# Altium schematic sheet DE-020717_1.SchDoc: CuC & SDRAM &  ANIN & DIO
size A3; Author: eldar6776@hotmail.com; DrawnBy: Dedic Eldar; Organization: I-MEDIA GROUP d.o.o.; Address1: Topal Osman Paše 18; Address2: 71000 Sarajevo; Address3: Federacija BiH; Address4: Bosna i Hercegovina; DocumentNumber: DE-020717; Revision: 001
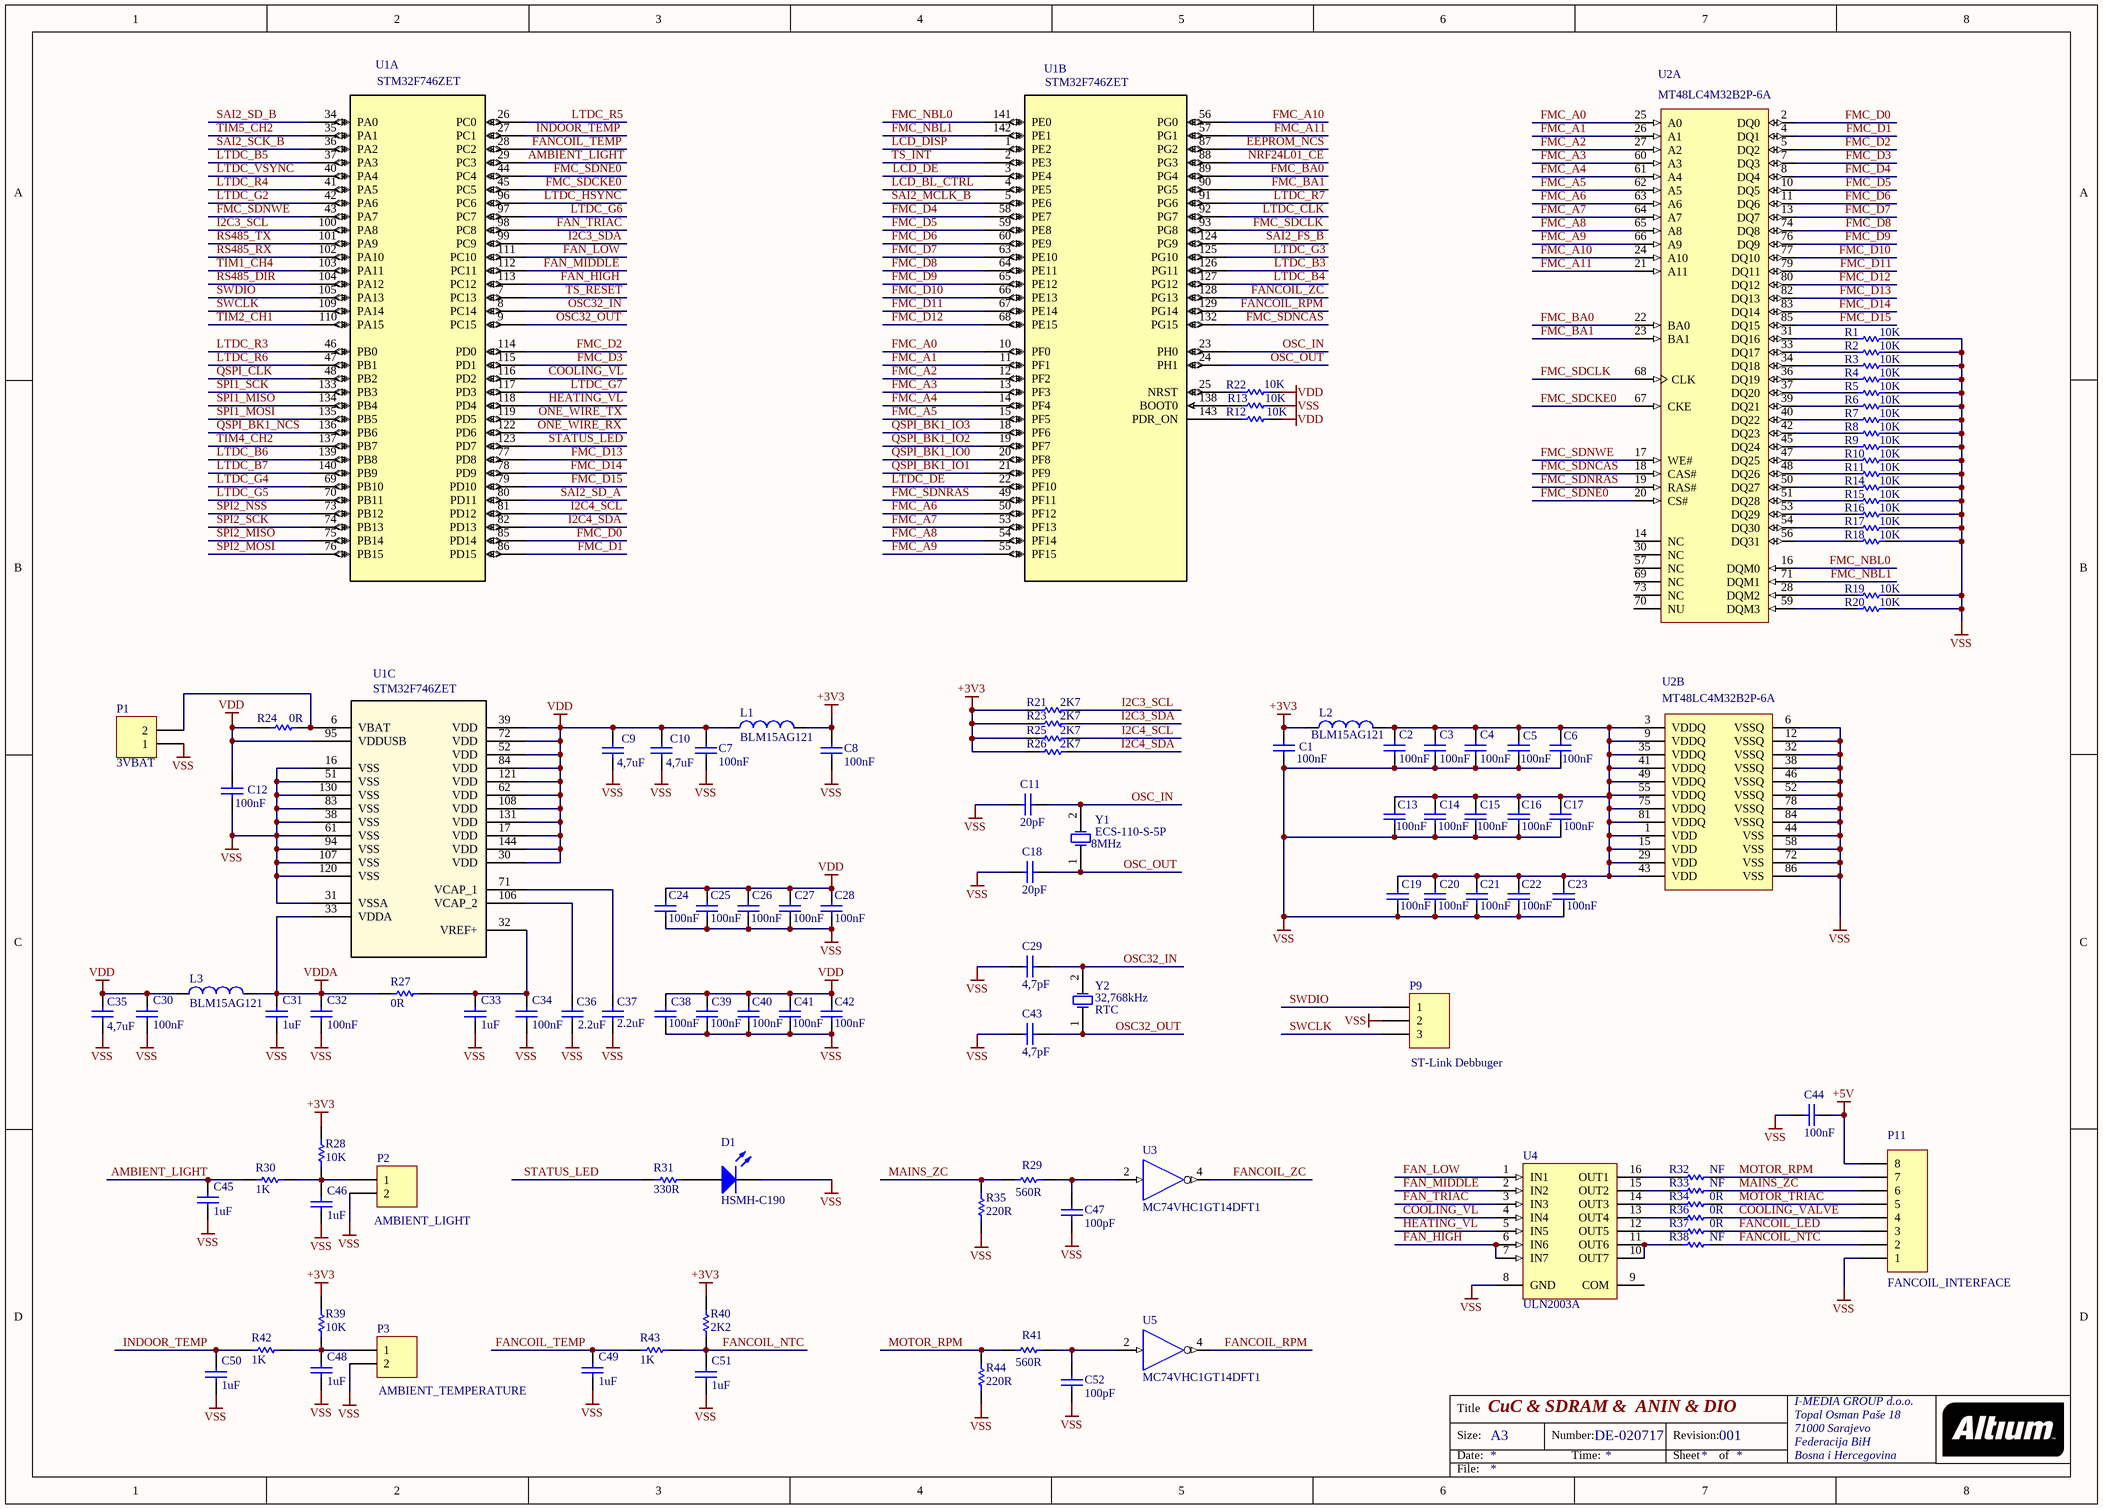
[diagram p0: DE-020717_1.SchDoc]

## Parts
C1  100nF  [0603]
C2  100nF  [0603]
C3  100nF  [0603]
C4  100nF  [0603]
C5  100nF  [0603]
C6  100nF  [0603]
C7  100nF  [0603]
C8  100nF  [0603]
C9  value 4,7uF  [0805]  (hidden comment: 4u7)
C10  value 4,7uF  [0805]  (hidden comment: 4u7)
C11  20pF  [0603]
C12  100nF  [0603]
C13  100nF  [0603]
C14  100nF  [0603]
C15  100nF  [0603]
C16  100nF  [0603]
C17  100nF  [0603]
C18  20pF  [0603]
C19  100nF  [0603]
C20  100nF  [0603]
C21  100nF  [0603]
C22  100nF  [0603]
C23  100nF  [0603]
C24  100nF  [0603]
C25  100nF  [0603]
C26  100nF  [0603]
C27  100nF  [0603]
C28  100nF  [0603]
C29  4,7pF  [0603]
C30  100nF  [0603]
C31  value 1uF  [0603]  (hidden comment: 100nF)
C32  100nF  [0603]
C33  value 1uF  [0603]  (hidden comment: 100nF)
C34  100nF  [0603]
C35  value 4,7uF  [0805]  (hidden comment: 4u7)
C36  value 2.2uF  [0603]  (hidden comment: 100nF)
C37  value 2.2uF  [0603]  (hidden comment: 100nF)
C38  100nF  [0603]
C39  100nF  [0603]
C40  100nF  [0603]
C41  100nF  [0603]
C42  100nF  [0603]
C43  4,7pF  [0603]
C44  100nF  [0603]
C45  value 1uF  [0603]  (hidden comment: 100nF)
C46  value 1uF  [0603]  (hidden comment: 100nF)
C47  100pF  [0603]
C48  value 1uF  [0603]  (hidden comment: 100nF)
C49  value 1uF  [0603]  (hidden comment: 100nF)
C50  value 1uF  [0603]  (hidden comment: 100nF)
C51  value 1uF  [0603]  (hidden comment: 100nF)
C52  100pF  [0603]
D1  HSMH-C190  [1.6X0.8X0.8A]
L1  BLM15AG121  [0603]
L2  BLM15AG121  [0603]
L3  BLM15AG121  [0603]
P1  3VBAT  [HDR1X2]
P2  AMBIENT_LIGHT  [HDR1X2]
P3  AMBIENT_TEMPERATURE  [HDR1X2]
P9  ST-Link Debbuger  [HDR1X3]
P11  FANCOIL_INTERFACE  [HDR1X8]
R1  10K  [2-0402]
R2  10K  [2-0402]
R3  10K  [2-0402]
R4  10K  [2-0402]
R5  10K  [2-0402]
R6  10K  [2-0402]
R7  10K  [2-0402]
R8  10K  [2-0402]
R9  10K  [2-0402]
R10  10K  [2-0402]
R11  10K  [2-0402]
R12  10K  [ERA-0603]
R13  10K  [ERA-0603]
R14  10K  [2-0402]
R15  10K  [2-0402]
R16  10K  [2-0402]
R17  10K  [2-0402]
R18  10K  [2-0402]
R19  10K  [2-0402]
R20  10K  [2-0402]
R21  2K7  [ERA-0603]
R22  10K  [ERA-0603]
R23  2K7  [ERA-0603]
R24  0R  [ERA-0603]
R25  2K7  [ERA-0603]
R26  2K7  [ERA-0603]
R27  0R  [ERA-0603]
R28  10K  [ERA-0603]
R29  560R  [ERA-0603]
R30  1K  [ERA-0603]
R31  330R  [ERA-0603]
R32  NF  [ERA-0603]
R33  NF  [ERA-0603]
R34  0R  [ERA-0603]
R35  220R  [ERA-0603]
R36  0R  [ERA-0603]
R37  0R  [ERA-0603]
R38  NF  [ERA-0603]
R39  10K  [ERA-0603]
R40  2K2  [ERA-0603]
R41  560R  [ERA-0603]
R42  1K  [ERA-0603]
R43  1K  [ERA-0603]
R44  220R  [ERA-0603]
U1  STM32F746ZET  [LQFP-144_20X20mm]  (parts A,B,C of 3)
U2  MT48LC4M32B2P-6A  [MICT-P-86_N]  (parts A,B of 2)
U3  MC74VHC1GT14DFT1  [419A-01_N]
U4  ULN2003A  [SO16_N]
U5  MC74VHC1GT14DFT1  [419A-01_N]
Y1  ECS-110-S-5P  value 8MHz  [CSM-7]
Y2  RTC  value 32,768kHz  [R38]

## Nets
+3V3: C1.2 C8.2 L1.2 L2.1 R21.1 R23.1 R25.1 R26.1 R28.2 R39.1 R40.2 U3.5(VDD) U5.5(VDD)
+5V: C44.2 P11.8
VDD: C7.2 C9.2 C10.2 C12.1 C24.2 C25.2 C26.2 C27.2 C28.2 C30.2 C35.2 C38.2 C39.2 C40.2 C41.2 C42.2 L1.1 L3.1 R12.2 R22.2 R24.1 U1.17(VDD) U1.30(VDD) U1.39(VDD) U1.52(VDD) U1.62(VDD) U1.72(VDD) U1.84(VDD) U1.95(VDDUSB) U1.108(VDD) U1.121(VDD) U1.131(VDD) U1.144(VDD)
VDDA: C31.2 C32.2 L3.2 R27.1 U1.33(VDDA)
VSS: C1.1 C2.1 C3.1 C4.1 C5.1 C6.1 C7.1 C8.1 C9.1 C10.1 C11.1 C12.2 C13.1 C14.1 C15.1 C16.1 C17.1 C18.1 C19.1 C20.1 C21.1 C22.1 C23.1 C24.1 C25.1 C26.1 C27.1 C28.1 C29.1 C30.1 C31.1 C32.1 C33.1 C34.1 C35.1 C36.1 C37.1 C38.1 C39.1 C40.1 C41.1 C42.1 C43.1 C44.1 C45.1 C46.1 C47.1 C48.1 C49.1 C50.1 C51.1 C52.1 D1.2(K) P1.1 P2.2 P3.2 P9.2 P11.1 R1.2 R2.2 R3.2 R4.2 R5.2 R6.2 R7.2 R8.2 R9.2 R10.2 R11.2 R13.2 R14.2 R15.2 R16.2 R17.2 R18.2 R19.2 R20.2 R35.1 R44.1 U1.16(VSS) U1.31(VSSA) U1.38(VSS) U1.51(VSS) U1.61(VSS) U1.83(VSS) U1.94(VSS) U1.107(VSS) U1.120(VSS) U1.130(VSS) U2.6(VSSQ) U2.12(VSSQ) U2.32(VSSQ) U2.38(VSSQ) U2.44(VSS) U2.46(VSSQ) U2.52(VSSQ) U2.58(VSS) U2.72(VSS) U2.78(VSSQ) U2.84(VSSQ) U2.86(VSS) U3.3(GND) U4.8(GND) U5.3(GND)
AMBIENT_LIGHT: C45.2 R30.1 U1.29(PC3)
COOLING_VALVE: P11.4 R36.2
COOLING_VL: U1.116(PD2) U4.4(IN4)
EEPROM_NCS: U1.87(PG2)
FAN_HIGH: U1.113(PC12) U4.6(IN6) U4.7(IN7)
FAN_LOW: U1.111(PC10) U4.1(IN1)
FAN_MIDDLE: U1.112(PC11) U4.2(IN2)
FAN_TRIAC: U1.98(PC8) U4.3(IN3)
FANCOIL_LED: P11.3 R37.2
FANCOIL_NTC: C51.2 P11.2 R38.2 R40.1 R43.2
FANCOIL_RPM: U1.129(PG14) U5.4(~{Y})
FANCOIL_TEMP: C49.2 R43.1 U1.28(PC2)
FANCOIL_ZC: U1.128(PG13) U3.4(~{Y})
FMC_A0: U1.10(PF0) U2.25(A0)
FMC_A1: U1.11(PF1) U2.26(A1)
FMC_A2: U1.12(PF2) U2.27(A2)
FMC_A3: U1.13(PF3) U2.60(A3)
FMC_A4: U1.14(PF4) U2.61(A4)
FMC_A5: U1.15(PF5) U2.62(A5)
FMC_A6: U1.50(PF12) U2.63(A6)
FMC_A7: U1.53(PF13) U2.64(A7)
FMC_A8: U1.54(PF14) U2.65(A8)
FMC_A9: U1.55(PF15) U2.66(A9)
FMC_A10: U1.56(PG0) U2.24(A10)
FMC_A11: U1.57(PG1) U2.21(A11)
FMC_BA0: U1.89(PG4) U2.22(BA0)
FMC_BA1: U1.90(PG5) U2.23(BA1)
FMC_D0: U1.85(PD14) U2.2(DQ0)
FMC_D1: U1.86(PD15) U2.4(DQ1)
FMC_D2: U1.114(PD0) U2.5(DQ2)
FMC_D3: U1.115(PD1) U2.7(DQ3)
FMC_D4: U1.58(PE7) U2.8(DQ4)
FMC_D5: U1.59(PE8) U2.10(DQ5)
FMC_D6: U1.60(PE9) U2.11(DQ6)
FMC_D7: U1.63(PE10) U2.13(DQ7)
FMC_D8: U1.64(PE11) U2.74(DQ8)
FMC_D9: U1.65(PE12) U2.76(DQ9)
FMC_D10: U1.66(PE13) U2.77(DQ10)
FMC_D11: U1.67(PE14) U2.79(DQ11)
FMC_D12: U1.68(PE15) U2.80(DQ12)
FMC_D13: U1.77(PD8) U2.82(DQ13)
FMC_D14: U1.78(PD9) U2.83(DQ14)
FMC_D15: U1.79(PD10) U2.85(DQ15)
FMC_NBL0: U1.141(PE0) U2.16(DQM0)
FMC_NBL1: U1.142(PE1) U2.71(DQM1)
FMC_SDCKE0: U1.45(PC5) U2.67(CKE)
FMC_SDCLK: U1.93(PG8) U2.68(CLK)
FMC_SDNCAS: U1.132(PG15) U2.18(CAS#)
FMC_SDNE0: U1.44(PC4) U2.20(CS#)
FMC_SDNRAS: U1.49(PF11) U2.19(RAS#)
FMC_SDNWE: U1.43(PA7) U2.17(WE#)
HEATING_VL: U1.118(PD4) U4.5(IN5)
I2C3_SCL: R21.2 U1.100(PA8)
I2C3_SDA: R23.2 U1.99(PC9)
I2C4_SCL: R25.2 U1.81(PD12)
I2C4_SDA: R26.2 U1.82(PD13)
INDOOR_TEMP: C50.2 R42.1 U1.27(PC1)
LCD_BL_CTRL: U1.4(PE5)
LCD_DE: U1.3(PE4)
LCD_DISP: U1.1(PE2)
LTDC_B3: U1.126(PG11)
LTDC_B4: U1.127(PG12)
LTDC_B5: U1.37(PA3)
LTDC_B6: U1.139(PB8)
LTDC_B7: U1.140(PB9)
LTDC_CLK: U1.92(PG7)
LTDC_DE: U1.22(PF10)
LTDC_G2: U1.42(PA6)
LTDC_G3: U1.125(PG10)
LTDC_G4: U1.69(PB10)
LTDC_G5: U1.70(PB11)
LTDC_G6: U1.97(PC7)
LTDC_G7: U1.117(PD3)
LTDC_HSYNC: U1.96(PC6)
LTDC_R3: U1.46(PB0)
LTDC_R4: U1.41(PA5)
LTDC_R5: U1.26(PC0)
LTDC_R6: U1.47(PB1)
LTDC_R7: U1.91(PG6)
LTDC_VSYNC: U1.40(PA4)
MAINS_ZC: P11.6 R29.1 R33.2 R35.2
MOTOR_RPM: P11.7 R32.2 R41.1 R44.2
MOTOR_TRIAC: P11.5 R34.2
NRF24L01_CE: U1.88(PG3)
ONE_WIRE_RX: U1.122(PD6)
ONE_WIRE_TX: U1.119(PD5)
OSC32_IN: C29.2 U1.8(PC14) Y2.2(OSC2)
OSC32_OUT: C43.2 U1.9(PC15) Y2.1(OSC1)
OSC_IN: C11.2 U1.23(PH0) Y1.2(OSC2)
OSC_OUT: C18.2 U1.24(PH1) Y1.1(OSC1)
QSPI_BK1_IO0: U1.20(PF8)
QSPI_BK1_IO1: U1.21(PF9)
QSPI_BK1_IO2: U1.19(PF7)
QSPI_BK1_IO3: U1.18(PF6)
QSPI_BK1_NCS: U1.136(PB6)
QSPI_CLK: U1.48(PB2)
RS485_DIR: U1.104(PA12)
RS485_RX: U1.102(PA10)
RS485_TX: U1.101(PA9)
SAI2_FS_B: U1.124(PG9)
SAI2_MCLK_B: U1.5(PE6)
SAI2_SCK_B: U1.36(PA2)
SAI2_SD_A: U1.80(PD11)
SAI2_SD_B: U1.34(PA0)
SPI1_MISO: U1.134(PB4)
SPI1_MOSI: U1.135(PB5)
SPI1_SCK: U1.133(PB3)
SPI2_MISO: U1.75(PB14)
SPI2_MOSI: U1.76(PB15)
SPI2_NSS: U1.73(PB12)
SPI2_SCK: U1.74(PB13)
STATUS_LED: R31.2 U1.123(PD7)
SWCLK: P9.3 U1.109(PA14)
SWDIO: P9.1 U1.105(PA13)
TIM1_CH4: U1.103(PA11)
TIM2_CH1: U1.110(PA15)
TIM4_CH2: U1.137(PB7)
TIM5_CH2: U1.35(PA1)
TS_INT: U1.2(PE3)
TS_RESET: U1.7(PC13)
NetC2_2: C2.2 C3.2 C4.2 C5.2 C6.2 C13.2 C14.2 C15.2 C16.2 C17.2 C19.2 C20.2 C21.2 C22.2 C23.2 L2.2 U2.1(VDD) U2.3(VDDQ) U2.9(VDDQ) U2.15(VDD) U2.29(VDD) U2.35(VDDQ) U2.41(VDDQ) U2.43(VDD) U2.49(VDDQ) U2.55(VDDQ) U2.75(VDDQ) U2.81(VDDQ)
NetC33_2: C33.2 C34.2 R27.2 U1.32(VREF+)
NetC36_2: C36.2 U1.106(VCAP_2)
NetC37_2: C37.2 U1.71(VCAP_1)
NetC46_2: C46.2 P2.1 R28.1 R30.2
NetC47_2: C47.2 R29.2 U3.2(A)
NetC48_2: C48.2 P3.1 R39.2 R42.2
NetC52_2: C52.2 R41.2 U5.2(A)
NetD1_1: D1.1(A) R31.1
NetP1_2: P1.2 R24.2 U1.6(VBAT)
NetR1_1: R1.1 U2.31(DQ16)
NetR2_1: R2.1 U2.33(DQ17)
NetR3_1: R3.1 U2.34(DQ18)
NetR4_1: R4.1 U2.36(DQ19)
NetR5_1: R5.1 U2.37(DQ20)
NetR6_1: R6.1 U2.39(DQ21)
NetR7_1: R7.1 U2.40(DQ22)
NetR8_1: R8.1 U2.42(DQ23)
NetR9_1: R9.1 U2.45(DQ24)
NetR10_1: R10.1 U2.47(DQ25)
NetR11_1: R11.1 U2.48(DQ26)
NetR12_1: R12.1 U1.143(PDR_ON)
NetR13_1: R13.1 U1.138(BOOT0)
NetR14_1: R14.1 U2.50(DQ27)
NetR15_1: R15.1 U2.51(DQ28)
NetR16_1: R16.1 U2.53(DQ29)
NetR17_1: R17.1 U2.54(DQ30)
NetR18_1: R18.1 U2.56(DQ31)
NetR19_1: R19.1 U2.28(DQM2)
NetR20_1: R20.1 U2.59(DQM3)
NetR22_1: R22.1 U1.25(NRST)
NetR32_1: R32.1 U4.16(OUT1)
NetR33_1: R33.1 U4.15(OUT2)
NetR34_1: R34.1 U4.14(OUT3)
NetR36_1: R36.1 U4.13(OUT4)
NetR37_1: R37.1 U4.12(OUT5)
NetR38_1: R38.1 U4.10(OUT7) U4.11(OUT6)

Not connected (* = marked no-connect by the designer): U2 14(NC) 30(NC) 57(NC) 69(NC) 70(NU) 73(NC); U4 9(COM)

## Notes on the sheet
- Title
- Size:
- Date:
- A3
- Number:
- Time:
- Revision:
- Sheet
- of
- File:

## Library data of the parts
C1-C8 C11-C34 C36-C52 = C0603: Ceramic Chip Capacitor - Standard; Note: Footprint corresponds to dimensions for bulk cassette packaging. This case size has tightened tolerances.; Published: 17-Jul-2002; LatestRevisionDate: 19-Mar-2004; LatestRevisionNote: Silkscreen size reduced.; DatasheetDocument: Mar-2001; PackageDocument: Mar-2001; PackageReference: 0603; Publisher: Altium Limited; Code_JEITA: 0603; Code_IPC: 1608 [0603]; ComponentLink1Description: Manufacturer Link; ComponentLink1URL: http://www.kemet.com/; ComponentLink2Description: Datasheet; ComponentLink2URL: http://www.kemet.com/kemet/web/homepage/kechome.nsf/vapubfilesname/F3102TA.pdf/$file/F3102TA.pdf
  C1-C8 C12-C17 C19-C28 C30 C32 C34 C38-C42 C44: Value: 100nF
  C11 C18: Value: 20pF
  C29 C43: Value: 4,7pF
  C47 C52: Value: 100pF
C9 C10 C35 = C0805: Ceramic Chip Capacitor - Standard; Note: Footprint corresponds to dimensions for bulk cassette packaging. This case size has tightened tolerances.; Published: 17-Jul-2002; LatestRevisionDate: 19-Mar-2004; LatestRevisionNote: Silkscreen size reduced.; DatasheetDocument: Mar-2001; PackageDocument: Mar-2001; PackageReference: 0805; Publisher: Altium Limited; Code_JEITA: 0805; Code_IPC: 2012[0805]; ComponentLink1Description: Manufacturer Link; ComponentLink1URL: http://www.kemet.com/; ComponentLink2Description: Datasheet; ComponentLink2URL: http://www.kemet.com/kemet/web/homepage/kechome.nsf/vapubfilesname/F3102TA.pdf/$file/F3102TA.pdf
D1 = HSMH-C190: Surface Mount Chip LED, Red; LuminousIntensity: 6.3mcd (Minimum).; PCB_Layout: Complies with manufacturer's recommendation.; Note: Anode mark shown on package.; Published: 11-Dec-2002; LatestRevisionDate: 27-Jun-2008; LatestRevisionNote: Polarity swapped to match Anode Mark.; DatasheetVersion: 30-Apr-2002; PackageVersion: Mar-2002; PackageReference: 1.6X0.8X0.8A; Publisher: Altium Limited; PackageDescription: SM LED; 2 Flat Leads; LED_Colour: Red; ComponentLink1Description: Manufacturer Link; ComponentLink1URL: http://www.avagotech.com/; ComponentLink2Description: Datasheet; ComponentLink2URL: http://cp.literature.agilent.com/litweb/pdf/5988-6271EN.pdf
L1-L3 = Inductor_SMD: Inductor; Code_IEC: 1005; Published: 8-Jun-2000; LatestRevisionDate: 29-May-2009; LatestRevisionNote: IPC-7351 Footprint Added.; PackageReference: 0402-A; Publisher: Altium Limited; PackageDescription: Chip Inductor; Code_JEITA: 0402
P1-P3 = Header 2: Header, 2-Pin; LatestRevisionDate: 17-Jul-2002; LatestRevisionNote: Re-released for DXP Platform.; Publisher: Altium Limited
P9 = Header 3: Header, 3-Pin; LatestRevisionDate: 17-Jul-2002; LatestRevisionNote: Re-released for DXP Platform.; Publisher: Altium Limited
P11 = Header 8: Header, 8-Pin; LatestRevisionDate: 17-Jul-2002; LatestRevisionNote: Re-released for DXP Platform.; Publisher: Altium Limited
R1-R11 R14-R20 = ERJ2GE: Thick Film Chip Resistor, 1 Ohm to 2.2M Ohm Range, 5% Tolerance, 0402 Size, 0.063 W; Note: If flow soldering, adjust pad width of PCB Footprint to 0.7 - 0.8 times the width of the resistor.; Published: 17-Dec-2003; LatestRevisionDate: 19-Mar-2004; LatestRevisionNote: Silkscreen size reduced.; PackageDocument: Mar-2003; PackageReference: 2-0402; Publisher: Altium Limited; Code_IPC: 1005 [0402]; ComponentLink1Description: Manufacturer Link; ComponentLink1URL: http://www.panasonic.com/industrial/components/resistive_products.htm; ComponentLink2Description: Datasheet; ComponentLink2URL: http://www.panasonic.com/industrial/components/pdf/AOA0000CE1.pdf
R12 R13 R21-R44 = ERA3Y: Rectangular Thick Film Chip Resistor, 10 Ohm to 330k Ohm Range, 0.1% and 0.5% Tolerance, 0603 Size, 0.063 W; Note: If flow soldering, adjust pad width of PCB Footprint to 0.7 - 0.8 times the width of the resistor.; Published: 17-Dec-2003; LatestRevisionDate: 19-Mar-2004; LatestRevisionNote: Silkscreen size reduced.; PackageDocument: Mar-2003; PackageReference: ERA-0603; Publisher: Altium Limited; Code_IPC: 1608 [0603]; ComponentLink1Description: Manufacturer Link; ComponentLink1URL: http://www.panasonic.com/industrial/components/resistive_products.htm; ComponentLink2Description: Datasheet; ComponentLink2URL: http://www.panasonic.com/industrial/components/pdf/AOA0000CE8.pdf
U1 = STM32F74XZXT: STM32F746ZET ARM Cortex M7 microcontroller; Vendor: STMicroelectronics; C: Copyright (C) 2016 Accelerated Designs. All rights reserved; Manufacturer_Part_Number: stm32f74xzxt; Copyright: Copyright (C) 2016 Accelerated Designs. All rights reserved; RefDes: RefDes; Type: Type; Value: Value
U2 = MT48LC4M32B2P-6A: 128Mb PC133 SDR SDRAM, 4Mb x 32, 6ns, 3.3V, 0 to 70 degC, 86-Pin TSOP, Pb-Free; Manufacturer: Micron; CL: CL = 3; Clock Rate: 166 MHz; Op. Temp.: 0C to +70C; DatasheetVersion: Rev.Q; PackageVersion: Rev.Q; PackageReference: MICT-P-86; PackageDescription: 86-PinThin Small Outline Package, 10.16 x 22.22 mm, Pitch 0.5 mm; Cycle Time: 6ns; Data Rate: PC133; Density: 128Mb; Depth: 4Mb; RoHS: Yes; Voltage: 3.3V; Width: x32; Mounting Technology: Surface Mount; PartNumber: MT48LC4M32B2P-6A; ComponentLink1Description: Manufacturer URL; ComponentLink1URL: http://www.micron.com/; ComponentLink2Description: Datasheet; ComponentLink2URL: http://www.micron.com/~/media/Documents/Products/Data%20Sheet/DRAM/128mb_x32_sdram.pdf; ComponentLink3Description: Package Specification; ComponentLink3URL: http://www.micron.com/~/media/Documents/Products/Data%20Sheet/DRAM/128mb_x32_sdram.pdf
U3 U5 = MC74VHC1GT14DFT1: Schmitt-Trigger Inverter / Logic Level Shifter with LSTTL-Compatible Inputs; Note: Pin 1 is NC and is not drawn.; Published: 15-Apr-2002; LatestRevisionDate: 12-Dec-2006; LatestRevisionNote: IPC-7351 Footprint Added.; DatasheetVersion: Nov-1999; PackageVersion: Oct-1999; PackageReference: 419A-01; Publisher: Altium Limited; PackageDescription: 5-Pin SOT-353 Package 0.65 mm Pitch, 2.1 mm Lead Span; ComponentLink1Description: Manufacturer Link; ComponentLink1URL: http://www.onsemi.com/; ComponentLink2Description: Datasheet; ComponentLink2URL: http://www.onsemi.com/pub/Collateral/MC74VHC1GT14-D.PDF
U4 = ULN2003D: Seven Darlington Array; Published: 8-Jun-2000; LatestRevisionDate: 13-Apr-2006; LatestRevisionNote: IPC-7351 Footprint Added.; DatasheetVersion: Sep-1998; PackageVersion: May-1998; PackageReference: SO16; Publisher: Altium Limited; PackageDescription: 16-Pin Small Outline Integrated Circuit 1.27 mm Pitch; Code_IPC: SOIC127P600-16; ComponentLink1Description: Manufacturer Link; ComponentLink1URL: http://www.st.com/; ComponentLink2Description: Datasheet; ComponentLink2URL: http://www.st.com/stonline/products/literature/ds/5279/uln2001.pdf
Y1 = ECS-110-S-5P: Crystal Oscillator; Published: 17-Jul-2002; DatasheetDocument: 18-Apr-2000; PackageReference: CSM-7; Publisher: Altium Limited; ComponentLink1Description: Manufacturer Link; ComponentLink1URL: http://www.ecsxtal.com/; ComponentLink2Description: Datasheet; ComponentLink2URL: http://www.ecsxtal.com/pdf3/CSM_7.pdf
Y2 = XTAL: Crystal Oscillator; Published: 8-Jun-2000; LatestRevisionDate: 17-Jul-2002; LatestRevisionNote: Re-released for DXP Platform.; PackageReference: R38; Publisher: Altium Limited; PackageDescription: Crystal, Thru-Hole; 2 Leads; Body 3.1 x 8.2 mm (Dia.xH)